# EAGLE design sceme1.0 (EAGLE 9.1.3)
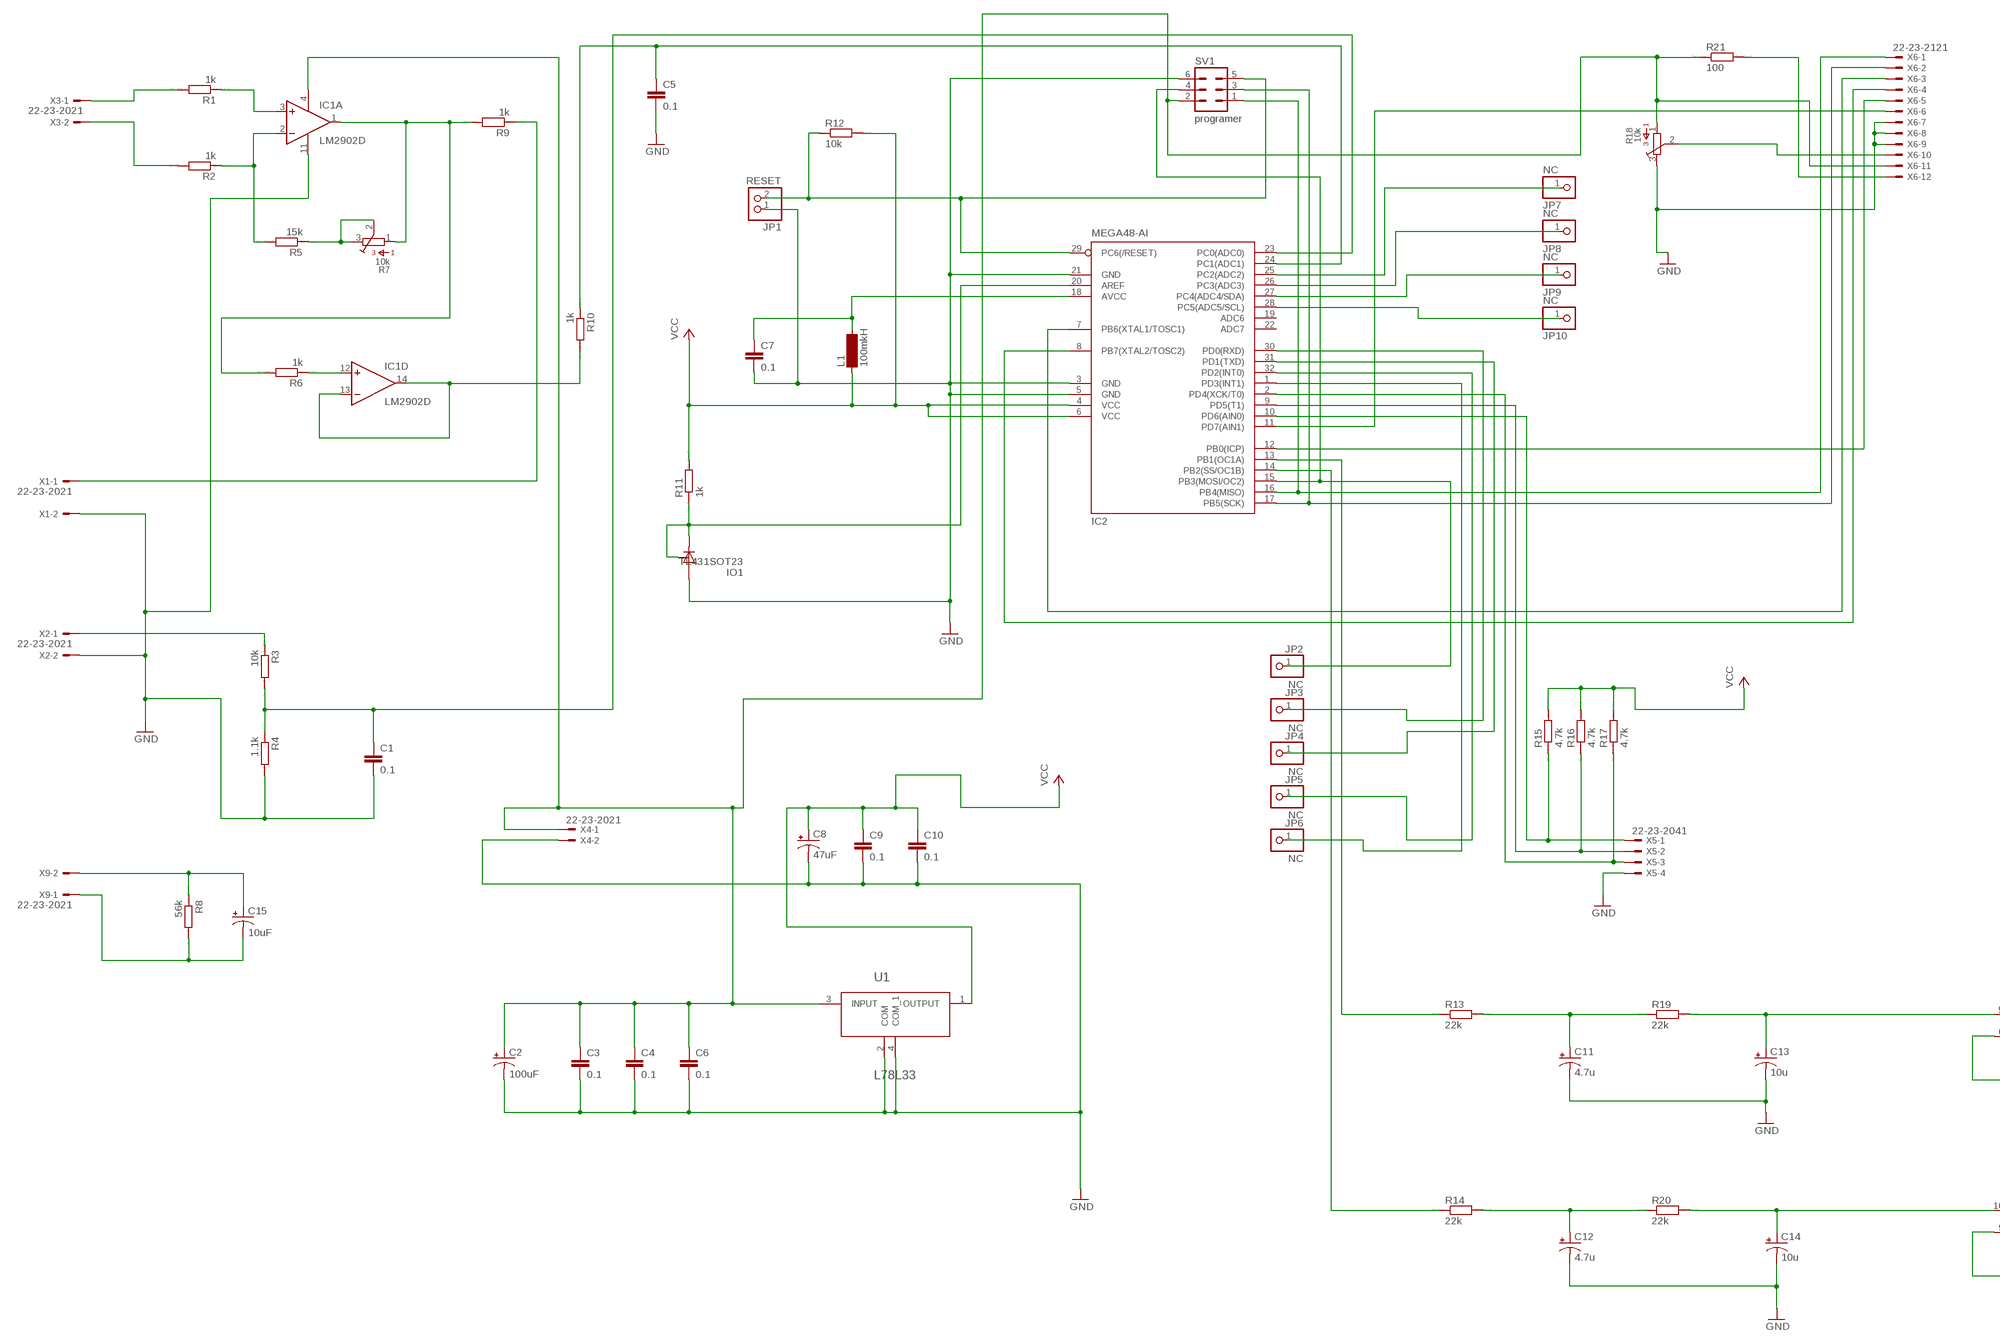
[diagram p0: schematic, sheet 1, part 1 of 2]
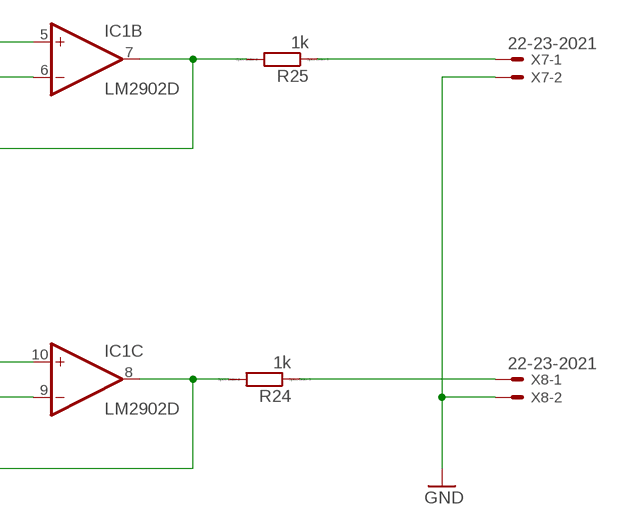
[diagram p1: schematic, sheet 1, part 2 of 2]

## Parts
C1  0.1  C-EUC0805  [C0805]
C2  100uF  CPOL-USE2.5-5  [E2,5-5]
C3  0.1  C-EUC0805  [C0805]
C4  0.1  C-EUC0805  [C0805]
C5  0.1  C-EUC0805  [C0805]
C6  0.1  C-EUC0805  [C0805]
C7  0.1  C-EUC0805  [C0805]
C8  47uF  CPOL-USE2.5-5  [E2,5-5]
C9  0.1  C-EUC0805  [C0805]
C10  0.1  C-EUC0805  [C0805]
C11  4.7u  CPOL-USE2.5-5  [E2,5-5]
C12  4.7u  CPOL-USE2.5-5  [E2,5-5]
C13  10u  CPOL-USE2.5-5  [E2,5-5]
C14  10u  CPOL-USE2.5-5  [E2,5-5]
C15  10uF  CPOL-USE2.5-5  [E2,5-5]
IC1  LM2902D  [SO14]
IC2  MEGA48-AI  MEGA8-AI  [TQFP32-08]
IO1  TL431SOT23  [SOT23]
JP1  RESET  PINHD-1X2  [1X02]
JP2  NC  PINHD-1X1  [1X01]
JP3  NC  PINHD-1X1  [1X01]
JP4  NC  PINHD-1X1  [1X01]
JP5  NC  PINHD-1X1  [1X01]
JP6  NC  PINHD-1X1  [1X01]
JP7  NC  PINHD-1X1  [1X01]
JP8  NC  PINHD-1X1  [1X01]
JP9  NC  PINHD-1X1  [1X01]
JP10  NC  PINHD-1X1  [1X01]
L1  100mkH  SM-1206  [SM-1206]
R1  1k  R  [R0805]
R2  1k  R  [R0805]
R3  10k  R  [R0805]
R4  1.1k  R  [R0805]
R5  15k  R  [R0805]
R6  1k  R  [R0805]
R7  10k  3362P  [3362P]
R8  56k  R  [R0805]
R9  1k  R  [R0805]
R10  1k  R  [R0805]
R11  1k  R  [R0805]
R12  10k  R  [R0805]
R13  22k  R  [R0805]
R14  22k  R  [R0805]
R15  4.7k  R  [R0805]
R16  4.7k  R  [R0805]
R17  4.7k  R  [R0805]
R18  10k  3362P  [3362P]
R19  22k  R  [R0805]
R20  22k  R  [R0805]
R21  100  R  [R0805]
R24  1k  R  [R0805]
R25  1k  R  [R0805]
SV1  programer  ML6  [ML6]
U1  L78L33  UA78L05CPK  [SOT150P400X160-4N]
X1  22-23-2021  [22-23-2021]
X2  22-23-2021  [22-23-2021]
X3  22-23-2021  [22-23-2021]
X4  22-23-2021  [22-23-2021]
X5  22-23-2041  [22-23-2041]
X6  22-23-2121  [22-23-2121]
X7  22-23-2021  [22-23-2021]
X8  22-23-2021  [22-23-2021]
X9  22-23-2021  [22-23-2021]

## Nets
GND: C1.2 C2.- C3.2 C4.2 C5.2 C6.2 C7.2 C8.- C9.2 C10.2 C11.- C12.- C13.- C14.- IC1.11(P:V-) IC2.3(GND) IC2.5(GND) IC2.21(GND) IO1.3(A) JP1.1 R4.2 R18.3 SV1.6 U1.2(COM) U1.4(COM_1) X1.2 X2.2 X4.2 X5.4 X6.7 X6.8 X6.9 X7.2 X8.2
N$1: C11.+ R13.2 R19.1
N$2: C13.+ IC1.5(B:+IN) R19.2
N$3: C12.+ R14.2 R20.1
N$4: C14.+ IC1.10(C:+IN) R20.2
N$5: IC2.20(AREF) IO1.1(C) IO1.2(R) R11.1
N$6: IC2.12(PB0(ICP)) X6.5
N$7: IC2.11(PD7(AIN1)) X6.6
N$8: R21.2 X6.12
N$9: C15.+ R8.1 X9.2
N$10: C7.1 IC2.18(AVCC) L1.2
N$11: R18.2 X6.10
N$12: IC2.29(PC6(/RESET)) JP1.2 R12.1 SV1.5
N$13: C15.- R8.2 X9.1
N$14: IC2.7(PB6(XTAL1/TOSC1)) X6.3
N$15: IC2.17(PB5(SCK)) SV1.3 X6.2
N$16: IC2.16(PB4(MISO)) SV1.1 X6.1
N$17: IC2.30(PD0(RXD)) JP3.1
N$18: IC2.31(PD1(TXD)) JP4.1
N$19: IC2.10(PD6(AIN0)) R15.1 X5.1
N$20: IC2.9(PD5(T1)) R16.1 X5.2
N$21: IC2.2(PD4(XCK/T0)) R17.1 X5.3
N$22: IC2.32(PD2(INT0)) JP5.1
N$23: IC2.1(PD3(INT1)) JP6.1
N$24: IC2.8(PB7(XTAL2/TOSC2)) X6.4
N$25: IC2.13(PB1(OC1A)) R13.1
N$26: IC2.14(PB2(SS/OC1B)) R14.1
N$27: IC2.15(PB3(MOSI/OC2)) JP2.1 SV1.4
N$28: IC1.8(C:OUT) IC1.9(C:-IN) R24.2
N$29: IC1.6(B:-IN) IC1.7(B:OUT) R25.2
N$30: IC1.3(A:+IN) R1.1
N$31: IC1.2(A:-IN) R2.1 R5.2
N$32: R5.1 R7.2 R7.3
N$33: IC1.1(A:OUT) R6.2 R7.1 R9.2
N$34: R1.2 X3.1
N$35: R25.1 X7.1
N$37: IC1.12(D:+IN) R6.1
N$38: C5.1 IC2.24(PC1(ADC1)) R10.1
N$39: R24.1 X8.1
N$40: R9.1 X1.1
N$41: R2.2 X3.2
N$42: C1.1 IC2.23(PC0(ADC0)) R3.2 R4.1
N$43: R3.1 X2.1
N$44: IC2.25(PC2(ADC2)) JP7.1
N$45: IC2.26(PC3(ADC3)) JP8.1
N$46: IC1.13(D:-IN) IC1.14(D:OUT) R10.2
N$47: IC2.27(PC4(ADC4/SDA)) JP9.1
N$48: IC2.28(PC5(ADC5/SCL)) JP10.1
N$57: C2.+ C3.1 C4.1 C6.1 IC1.4(P:V+) R18.1 R21.1 SV1.2 U1.3(INPUT) X4.1 X6.11
VCC: C8.+ C9.1 C10.1 IC2.4(VCC) IC2.6(VCC) L1.1 R11.2 R12.2 R15.2 R16.2 R17.2 U1.1(OUTPUT)
Unconnected: IC2.19(ADC6) IC2.22(ADC7)

## Library data of the parts
C1 C3-C7 C9 C10 = rcl:C-EU: CAPACITOR, European symbol
C2 C8 C11-C15 = rcl:CPOL-US: POLARIZED CAPACITOR, American symbol; SPICEPREFIX: C
IC1 = linear:LM2902: Low power quad operational amplifier Source: Data sgeet <http://www.st.com/internet/com/TECHNICAL_RESOURCES/TECHNICAL_LITERATURE/DATASHEET/CD00000533.pdf>
IC2 = atmel:MEGA8: MICROCONTROLLER 8 Kbytes FLASH, 1 kbytes SRAM, 512 bytes EEPROM, USART, 6-channel 10 bit ADC, 2-channel 8 bit ADC Pin compatible with Atmega48, ATMega88, ATMega168 Source: avr.lbr; MPN: ATMEGA8-16AU; OC_FARNELL: 9171371; OC_NEWARK: 73M8863
IO1 = tl431me:TL431: Programmable Shunt Regulator TL431 Features > Programmable Output Voltage to 36 Volts > Low Dynamic Output Impedance 0.2? Typical > Sink Current Capability of 1.0 to 100mA > Equivalent Full-Range Temperature Coefficient of 50ppm/°C Typical > Temperature Compensated For Operation Over Full Rated Operating Temperature Range > Low Output Noise Voltage > Fast Turn-on Response; MPN: TL431BFDT; OC_FARNELL: 2095471; PACKAGE: SOT23; SUPPLIER: NXP
JP1 = pinhead:PINHD-1X2: PIN HEADER
JP2-JP10 = pinhead:PINHD-1X1: PIN HEADER
L1 = inductor-neosid:SM-1206: INDUCTOR SMD chip inductor; OC_FARNELL: unknown; OC_NEWARK: unknown
R1-R6 R8-R17 R19-R21 R24 R25 = eagle-ltspice:R: RESISTOR, European symbol; SPICEMODEL: NONE; SPICEPREFIX: R
R7 R18 = bourns:3362: 3362 Series 1/4" Square Trimmer
SV1 = con-harting-ml:ML6: HARTING; OC_FARNELL: unknown; OC_NEWARK: unknown
U1 = TI-Eagle_library:UA78L05: μA78L00 SERIES POSITIVE-VOLTAGE REGULATORS,SOT-89-3; MPN: UA78L05CPK; OC_FARNELL: 2112604; OC_NEWARK: 77C1862; PACKAGE: SOT-89-3; SUPPLIER: TEXAS INSTRUMENTS
X1-X4 X7-X9 = con-molex:22-23-2021: .100" (2.54mm) Center Header - 2 Pin; MF: MOLEX; MPN: 22-23-2021; OC_FARNELL: 1462926; OC_NEWARK: 25C3832
X5 = con-molex:22-23-2041: .100" (2.54mm) Center Header - 4 Pin; MF: MOLEX; MPN: 22-23-2041; OC_FARNELL: 1462920; OC_NEWARK: 38C0355
X6 = con-molex:22-23-2121: .100" (2.54mm) Center Header - 12 Pin; MF: MOLEX; MPN: 22-23-2121; OC_FARNELL: 1462935; OC_NEWARK: 56H0456

## Net classes
0 default: clearance 0.205 mm

## Board
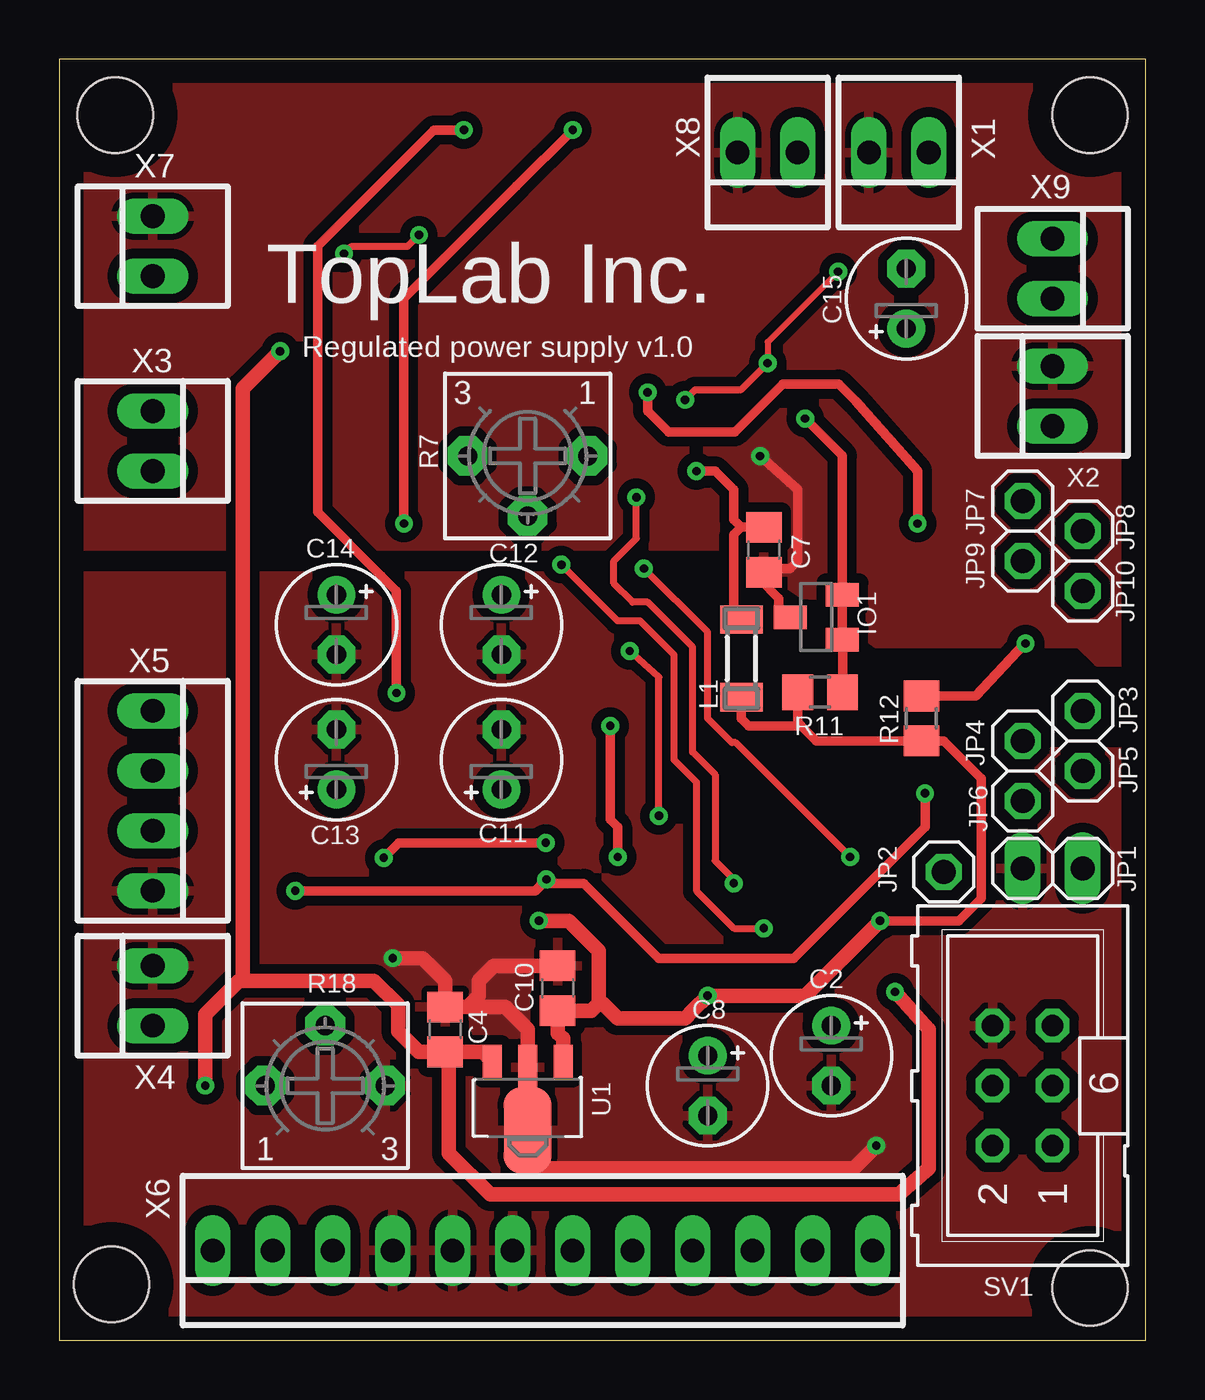
[diagram p2: board, top side]
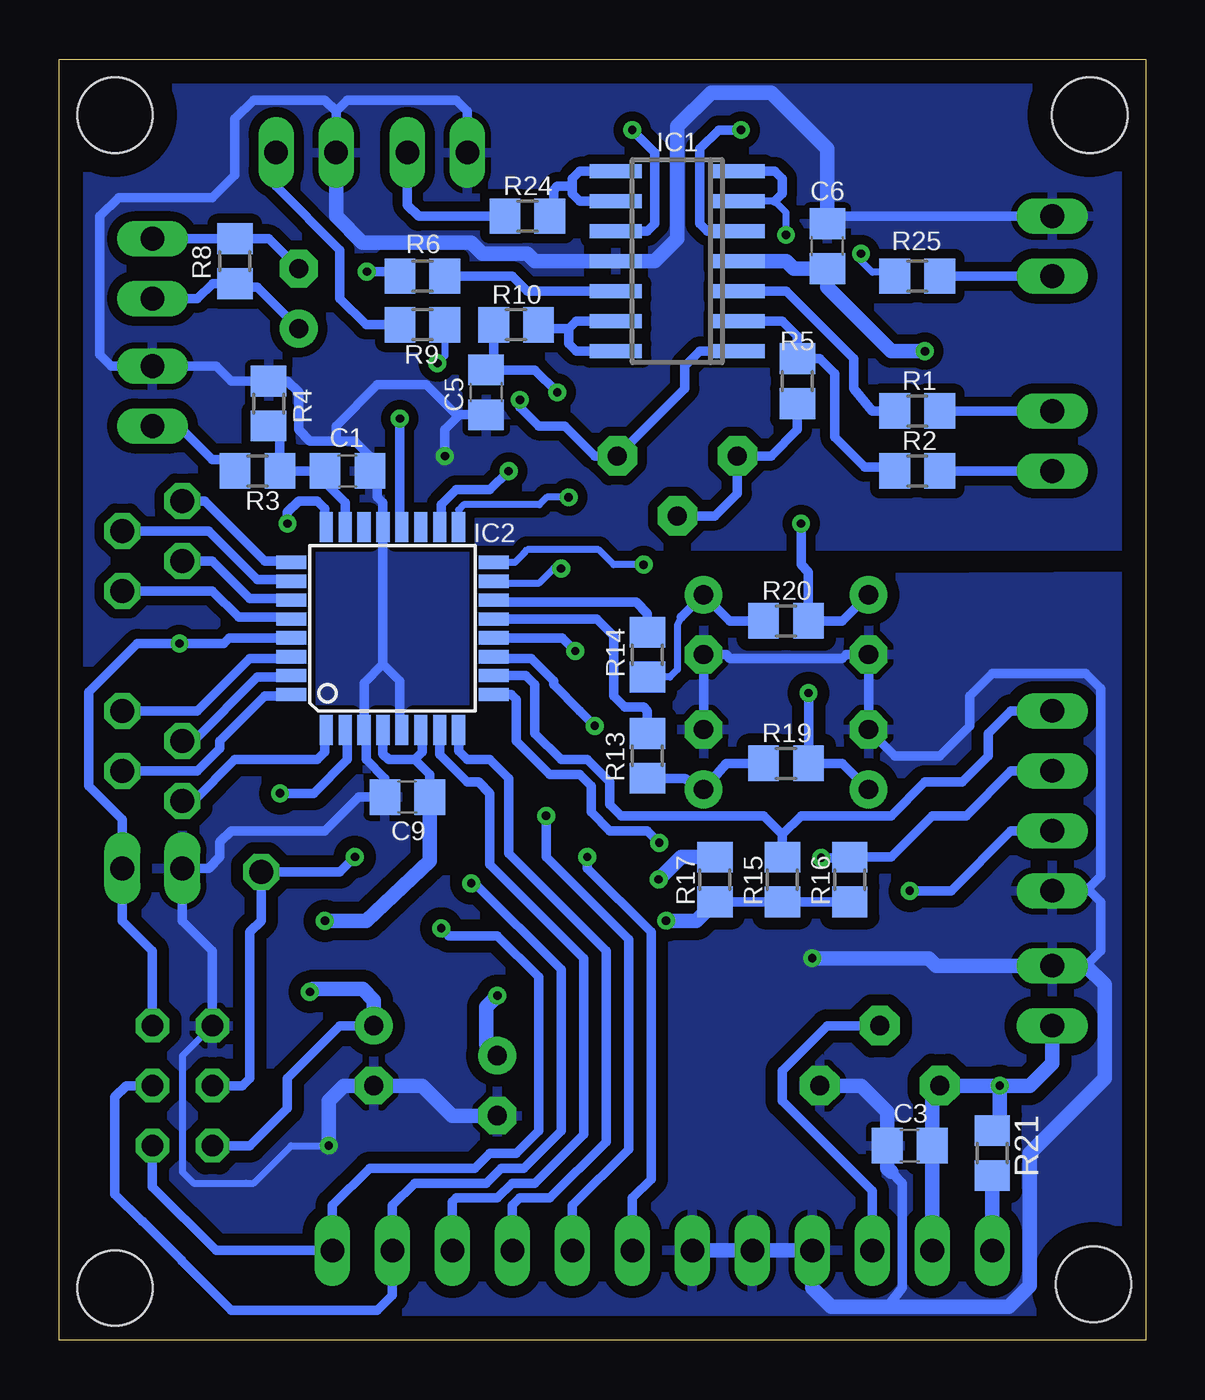
[diagram p3: board, bottom side, seen from below]

Size 46.02 x 54.28 mm. Coordinates in mm from the lower left corner, seen from the top.
Outline: 0,0 46.02,0 46.02,54.28 0,54.28 0,0
Copper layers (1*16): Top 0.035mm / dielectric 1.5mm / Bottom 0.035mm
Design rules "default": minimum track width 10mil, minimum drill 24mil, track to track 8mil, track to pad 8mil, pad to pad 8mil, via to via 8mil, smd to smd 8mil, copper to edge 40mil, drill to drill 8mil, minimum pad ring 10mil, minimum via ring 8mil, stop-mask expansion 4mil, vias tented up to drill 0mil, thermal gap 10mil
Holes 3.2 mm at 2.22,2.38 43.66,2.22 2.38,51.91 43.66,51.91

### Footprints (pad centres in the part's own frame; a part is rotated, then mirrored left to right if it is on the bottom)
C0805 = smd 1.3 x 1.5: 1 -0.95,0; 2 0.95,0
E2,5-5 = drill 0.813 pad 1.6: + -1.27,0 | drill 0.813 pad 1.6 octagon: - 1.27,0
SO14 = smd 0.6 x 2.2: 1 -3.81,-2.6; 2 -2.54,-2.6; 3 -1.27,-2.6; 4 0,-2.6; 5 1.27,-2.6; 6 2.54,-2.6; 7 3.81,-2.6; 8 3.81,2.6; 9 2.54,2.6; 10 1.27,2.6; 11 0,2.6; 12 -1.27,2.6; 13 -2.54,2.6; 14 -3.81,2.6
TQFP32-08 = smd 1.27 x 0.559: 1 -4.293,2.8; 2 -4.293,2; 3 -4.293,1.2; 4 -4.293,0.4; 5 -4.293,-0.4; 6 -4.293,-1.2; 7 -4.293,-2; 8 -4.293,-2.8; 17 4.293,-2.8; 18 4.293,-2; 19 4.293,-1.2; 20 4.293,-0.4; 21 4.293,0.4; 22 4.293,1.2; 23 4.293,2; 24 4.293,2.8 | smd 0.559 x 1.27: 9 -2.8,-4.293; 10 -2,-4.293; 11 -1.2,-4.293; 12 -0.4,-4.293; 13 0.4,-4.293; 14 1.2,-4.293; 15 2,-4.293; 16 2.8,-4.293; 25 2.8,4.293; 26 2,4.293; 27 1.2,4.293; 28 0.4,4.293; 29 -0.4,4.293; 30 -1.2,4.293; 31 -2,4.293; 32 -2.8,4.293
SOT23 = smd 1 x 1.4: 1 -0.95,-1.1; 2 0.95,-1.1; 3 0,1.1
1X02 = drill 1.016 long: 1 -1.27,0; 2 1.27,0
1X01 = drill 1.016 octagon: 1 0,0
SM-1206 = smd 1.2 x 1.8: 1 -1.65,0; 2 1.65,0
R0805 = smd 1.3 x 1.5: 1 -0.95,0; 2 0.95,0
3362P = drill 0.813 pad 1.676 octagon: 1 -2.54,0; 2 0,2.54; 3 2.54,0
ML6 = drill 0.914 octagon: 1 -2.54,-1.27; 2 -2.54,1.27; 3 0,-1.27; 4 0,1.27; 5 2.54,-1.27; 6 2.54,1.27
SOT150P400X160-4N = smd 0.8 x 1.4: 1 -1.499,-1.981; 3 1.499,-1.981 | smd 0.8 x 1.9: 2 0,-1.727 | smd 2.032 x 3.65: 4 0,0.94
22-23-2021 = drill 1 long: 1 -1.27,0; 2 1.27,0
22-23-2041 = drill 1 long: 1 -3.81,0; 2 -1.27,0; 3 1.27,0; 4 3.81,0
22-23-2121 = drill 1 long: 1 -13.97,0; 2 -11.43,0; 3 -8.89,0; 4 -6.35,0; 5 -3.81,0; 6 -1.27,0; 7 1.27,0; 8 3.81,0; 9 6.35,0; 10 8.89,0; 11 11.43,0; 12 13.97,0

### Placement (x,y rotation side)
C1  33.81,36.83 0 bottom
C2  32.7,12.06 270 top
C3  10,8.26 180 bottom
C4  16.35,13.18 90 top
C5  27.94,40.16 270 bottom
C6  13.49,46.35 90 bottom
C7  29.84,33.5 270 top
C8  27.46,10.79 270 top
C9  31.27,23.02 180 bottom
C10  21.11,14.92 90 top
C11  18.73,24.61 90 top
C12  18.73,30.32 270 top
C13  11.75,24.61 90 top
C14  11.75,30.32 270 top
C15  35.88,44.13 90 top
IC1  19.84,45.72 90 bottom
IC2  31.91,30.16 90 bottom
IO1  32.07,30.64 90 top
JP1  42.07,20 0 top
JP2  37.47,19.84 0 top
JP3  43.34,26.67 0 top
JP4  40.8,25.4 0 top
JP5  43.34,24.13 0 top
JP6  40.8,22.86 0 top
JP7  40.8,35.56 0 top
JP8  43.34,34.29 0 top
JP9  40.8,33.02 0 top
JP10  43.34,31.75 0 top
L1  28.89,28.89 90 top
R1  9.68,39.37 0 bottom
R2  9.68,36.83 0 bottom
R3  37.62,36.83 0 bottom
R4  37.15,39.69 90 bottom
R5  14.76,40.64 90 bottom
R6  30.64,45.09 180 bottom
R7  19.84,37.47 180 top
R8  38.58,45.72 90 bottom
R9  30.64,43.02 0 bottom
R10  26.67,43.02 0 bottom
R11  32.23,27.46 180 top
R12  36.51,26.35 270 top
R13  21.11,24.77 270 bottom
R14  21.11,29.05 270 bottom
R15  15.4,19.53 270 bottom
R16  12.54,19.53 270 bottom
R17  18.26,19.53 270 bottom
R18  11.27,10.79 0 top
R19  15.24,24.45 0 bottom
R20  15.24,30.48 0 bottom
R21  6.51,7.94 270 bottom
R24  26.19,47.62 0 bottom
R25  9.68,45.09 180 bottom
SV1  40.8,10.79 90 top
U1  19.84,9.84 180 top
X1  35.56,50.32 180 top
X2  42.07,40.01 90 top
X3  3.97,38.1 270 top
X4  3.97,14.61 90 top
X5  3.97,22.86 270 top
X6  20.48,3.81 180 top
X7  3.97,46.35 90 top
X8  30,50.32 180 top
X9  42.07,45.4 270 top

### Tracks (layer width: path | path; a pad name or v marks a point on that pad's centre or on a via)
GND  (via drill 0.35 pad 0.75)
  Top 0.406: 30.48,30.96 30.48,30.8 30.64,30.64 IO1.3 30.8,30.64 30.48,30.96 | 30.48,30.96 30.48,31.43 29.69,32.23 29.84,32.23 30.32,32.7 30.96,32.7 31.27,33.02 31.27,36.04 v29.69,37.47 | U1.2 U1.4
  Top 0.61: C10.2 18.41,15.88 17.78,15.24 17.78,14.61 17.3,14.13 | v14.13,16.19 15.4,16.19 16.35,15.24 C4.2 17.3,14.13 | U1.4 19.84,7.3 33.66,7.3 v34.61,8.26 | U1.2 19.84,13.18 18.89,14.13 17.3,14.13
  Bottom 0.305: SV1.6 40.8,12.06 40.8,7.14 40.32,6.67 38.1,6.67 37.78,6.67 36.2,8.26 v34.61,8.26
  Bottom 0.406: SV1.6 39.53,16.51 40.8,17.78 JP1.1 39.69,20 39.21,20.48 39.21,21.11 38.73,21.59 34.77,21.59 33.34,23.02 C9.2 32.22,23.81 33.02,24.61 33.02,25.78 IC2.3 33.11,27.86 32.31,28.66 | 10.79,7.14 10.32,6.67 10.32,2.22 10.95,1.43 | X7.2 13.17,47.62 C6.2 | C11.- C12.- 17.78,29.05 17.62,28.89 12.86,28.89 12.7,29.05 C14.- C13.- 10.64,24.77 8.73,24.77 7.46,26.04 7.46,27.3 6.51,28.26 2.54,28.26 1.91,27.62 1.91,19.68 2.38,19.21 | 34.29,38.1 33.5,38.1 32.86,37.47 C1.2 32.54,36.51 32.54,35.72 32.31,35.48 IC2.21 32.31,28.66 | 34.29,38.1 35.4,38.1 35.88,38.58 35.88,40.16 36.35,40.64 R4.2 38.73,40.64 39.37,41.27 X2.2 43.81,41.27 44.29,41.75 44.29,47.62 43.5,48.42 39.53,48.42 38.58,49.37 38.58,51.75 37.78,52.55 34.77,52.55 34.29,52.07 | X8.2 28.73,52.07 29.21,52.55 33.81,52.55 34.29,52.07 | X1.2 34.29,52.07 | 2.38,19.21 2.38,19.05 1.91,18.57 1.91,16.51 2.54,15.88 X4.2 | X5.4 2.54,19.05 2.38,19.21 | C5.2 29.05,39.21 | 29.05,39.21 29.21,39.21 30.48,40.48 32.54,40.48 34.29,38.73 34.29,38.1 | 32.31,28.66 31.59,27.94 31.59,25.95 IC2.5 | v29.69,37.47 29.69,38.58 29.05,39.21
  Bottom 0.61: X6.7 X6.8 X6.9 14.13,2.22 13.34,1.43 10.95,1.43 5.81,1.43 4.92,2.32 4.92,7.94 1.75,11.11 1.75,15.08 2.54,15.88 | 10.79,7.14 10.95,7.3 C3.2 10.95,9.68 12.06,10.79 R18.3 | C6.2 13.49,50.48 15.88,52.86 18.41,52.86 19.84,51.44 19.84,46.67 20.8,45.72 IC1.11 25.88,45.72 26.19,46.04 28.1,46.04 28.57,46.51 33.18,46.51 34.29,47.62 X1.2 | X4.2 8.89,15.88 9.21,16.19 v14.13,16.19 | v34.61,8.26 34.61,10.16 33.97,10.79 C2.- 30.64,10.79 29.37,9.53 C8.-
  pour Bottom (isolate 0.406): 0.32,53.98 45.72,53.98 45.72,28.73 43.97,28.73 43.18,29.53 35.4,29.53 35.4,26.67 28.42,26.67 28.42,33.66 0.32,33.66
  pour Top (isolate 0.406): 0.32,53.98 45.72,53.98 45.72,28.73 43.97,28.73 43.18,29.53 34.61,29.53 28.42,33.66 0.32,33.66
  pour Bottom (isolate 0.508): 0.32,32.38 25.4,32.23 25.4,24.92 45.88,24.92 45.88,0.16 0.16,0 0.16,32.38
  pour Top (isolate 0.406): 25.4,32.38 0.16,32.38 0.16,0 45.88,0 45.88,24.92 25.4,24.92
N$1
  Bottom 0.406: R13.2 19.52,23.81 C11.+ 17.78,24.45 R19.1
N$2  (via drill 0.35 pad 0.75)
  Top 0.406: v14.29,27.43 14.29,31.75 13.65,32.38 10.95,35.08 10.95,46.35 15.88,51.28 v17.14,51.28
  Bottom 0.406: R19.2 14.13,24.29 | C13.+ 12.86,24.45 R19.2 | v17.14,51.28 18.1,51.28 18.89,50.48 18.89,47.31 18.57,46.99 IC1.5 | R19.2 v14.29,27.43
N$3
  Bottom 0.305: 19.68,30.64 19.84,30.32 19.84,28.42 20.16,28.1 R14.2
  Bottom 0.406: 19.68,30.64 C12.+ 17.62,30.48 R20.1
N$4  (via drill 0.35 pad 0.75)
  Top 0.406: v14.61,34.61 14.61,44.13 19.37,48.9 v21.75,51.28
  Bottom 0.406: C14.+ 12.86,30.48 R20.2 14.29,32.55 14.61,32.86 v14.61,34.61 | v21.75,51.28 20.8,50.32 20.8,47.31 21.11,46.99 IC1.10
N$5  (via drill 0.35 pad 0.75)
  Top 0.406: R11.1 IO1.1 IO1.2 33.17,37.48 v31.59,39.05
  Bottom 0.406: IC2.20 31.59,34.54 v31.59,39.05 31.51,39.13
N$6  (via drill 0.35 pad 0.75)
  Top 0.305: v25.4,22.23 25.4,28.1 v24.16,29.21
  Bottom 0.406: X6.5 24.29,5.71 21.91,8.1 21.91,16.99 25.4,20.48 v25.4,22.23 | v24.16,29.21 24.71,29.76 IC2.12
N$7  (via drill 0.35 pad 0.75)
  Top 0.406: v23.34,26.04 23.34,22.07 23.65,21.75 v23.65,20.48
  Bottom 0.406: X6.6 21.75,6.03 20.95,6.83 20.95,17.3 23.65,20 v23.65,20.48 | IC2.11 27.55,28.89 26.04,28.89 25.08,27.94 25.08,27.78 23.97,26.67 v23.34,26.04
N$8
  Bottom 0.61: X6.12 R21.2
N$9
  Bottom 0.406: C15.+ 37.62,44.61 38.41,44.61 R8.1 39.53,44.77 40.16,44.13 X9.2
N$10  (via drill 0.35 pad 0.75)
  Top 0.406: L1.2 28.89,30.64 28.57,30.96 28.57,34.13 28.89,34.45 | 28.89,34.45 C7.1 | v26.99,36.83 27.78,36.83 28.57,36.04 28.57,34.77 28.89,34.45
  Bottom 0.406: IC2.18 29.84,34.52 29.84,35.4 29.21,36.04 27.78,36.04 v26.99,36.83
N$11
  Bottom 0.406: R18.2 13.49,13.34 15.4,11.43 15.4,10.16 11.59,6.35 X6.10
N$12  (via drill 0.35 pad 0.75)
  Top 0.406: R12.1 36.67,27.31 38.83,27.3 40.89,29.53 v40.93,29.53
  Bottom 0.406: SV1.5 42.07,16.51 43.34,17.78 JP1.2 43.34,22.07 44.77,23.5 44.77,27.46 42.7,29.53 v40.93,29.53 39.05,29.53 38.82,29.76 IC2.29
N$13
  Bottom 0.406: X9.1 R8.2 37.15,46.67 C15.-
N$14
  Bottom 0.406: X6.3 29.37,5.87 29.21,6.03 27.46,6.03 26.83,6.67 25.88,6.67 23.81,8.73 23.81,16.19 27.78,20.16 27.78,23.18 28.26,23.65 28.73,23.65 29.91,24.83 IC2.7
N$15  (via drill 0.35 pad 0.75)
  Top 0.305: v28.57,19.37 28.57,19.53 27.78,20.32 27.78,23.97 26.83,24.92 26.83,29.37 24.92,31.27 24.29,31.27 23.5,32.07 23.5,33.02 24.45,33.97 v24.45,35.72
  Bottom 0.305: IC2.17 29.11,35.19 28.89,35.4 25.69,35.4 25.37,35.72 v24.45,35.72
  Bottom 0.406: v28.57,19.37 28.42,19.37 24.77,15.72 24.77,8.89 26.35,7.3 27.3,7.3 27.94,6.67 30.96,6.67 31.91,5.71 X6.2 31.91,1.91 32.54,1.27 38.73,1.27 40.84,3.37 40.84,3.39 42.49,5.04 42.51,5.04 43.66,6.19 43.66,10.32 43.18,10.79 SV1.3
N$16  (via drill 0.35 pad 0.75)
  Top 0.305: v21.27,32.86 23.65,30.48 23.81,30.48 24.61,30.48 26.04,29.05 26.04,24.61 26.99,23.65 26.99,19.05 28.57,17.46 v29.84,17.46
  Bottom 0.305: IC2.16 26.73,32.96 26.35,33.34 26.19,33.5 23.18,33.5 22.54,32.86 v21.27,32.86
  Bottom 0.406: v29.84,17.46 29.53,17.14 27.46,17.14 25.72,15.4 25.72,8.89 26.67,7.94 27.78,7.94 28.42,7.3 32.86,7.3 34.45,5.71 X6.1 39.37,3.81 42.07,6.51 SV1.1
N$17
  Bottom 0.406: IC2.30 36.27,28.89 37.94,28.89 40.16,26.67 JP3.1
N$18
  Bottom 0.406: IC2.31 36.27,28.1 37.62,28.1 40.32,25.4 JP4.1
N$19
  Bottom 0.406: X5.1 5.71,26.67 6.67,25.72 6.67,24.77 7.78,23.65 9.37,23.65 10.79,22.23 14.61,22.23 15.4,21.43 | R15.1 15.4,21.43 | 15.4,21.43 16.19,22.23 22.23,22.23 22.7,22.7 22.7,23.65 23.65,24.61 24.77,24.61 25.88,25.72 25.88,27.78 26.26,28.16 IC2.10
N$20  (via drill 0.35)
  Top 0.406: v20.61,21.08 14.38,21.08 v13.75,20.45
  Bottom 0.406: X5.2 5.71,24.13 7.62,22.23 9.05,22.23 10.79,20.48 R16.1 12.57,20.45 v13.75,20.45 | IC2.9 26.89,27.36 26.67,27.15 26.67,25.4 25.24,23.97 23.97,23.97 23.5,23.5 23.5,22.38 22.7,21.59 21.11,21.59 v20.61,21.08
N$21  (via drill 0.35 pad 0.75)
  Top 0.406: v36.67,23.18 36.67,21.75 31.11,16.19 25.4,16.19 22.23,19.37 20.8,19.37 v20.64,19.53 20.16,19.05 v10,19.05
  Bottom 0.305: 33.97,25.81 IC2.2
  Bottom 0.406: X5.3 5.71,21.59 8.26,19.05 v10,19.05 | R17.1 | 20.48,19.53 v20.64,19.53 | IC2.2 33.81,25.77 33.81,24.61 35.24,23.18 v36.67,23.18
  Bottom 0.61: v20.64,19.53 19.69,20.48 R17.1
N$22
  Bottom 0.406: IC2.32 36.26,27.3 37.31,27.3 39.21,25.4 39.21,25.08 40.16,24.13 JP5.1
N$23
  Bottom 0.406: IC2.1 34.77,25.81 34.77,24.92 35.08,24.61 38.58,24.61 40.32,22.86 JP6.1
N$24
  Bottom 0.406: X6.4 26.83,5.71 26.51,6.03 25.24,6.03 22.86,8.41 22.86,16.51 26.99,20.64 26.99,23.81 27.78,24.61 28.73,24.61 29.11,24.98 IC2.8
N$25
  Bottom 0.406: R13.1 21.11,26.67 21.27,26.83 22.07,26.83 22.54,27.3 22.54,29.84 23.26,30.56 IC2.13
N$26
  Bottom 0.406: IC2.14 27.53,31.27 21.59,31.27 21.11,30.8 R14.1
N$27  (via drill 0.35 pad 0.75)
  Top 0.305: v24.77,32.7 27.46,30 27.46,26.35 28.5,25.32 28.65,25.32 v33.5,20.48
  Bottom 0.305: v24.77,32.7 25.08,32.7 25.72,32.07 27.52,32.07 IC2.15
  Bottom 0.406: SV1.4 38.26,10.79 37.94,11.11 37.94,17.3 37.47,17.78 JP2.1 34.13,19.84 v33.5,20.48
N$28
  Bottom 0.406: IC1.8 23.97,49.53 24.29,49.21 24.29,48.9 | 24.29,48.9 24.29,48.58 23.97,48.26 IC1.9 | R24.2 25.08,47.79 25.08,48.74 24.92,48.9 24.29,48.9
N$29  (via drill 0.35)
  Top 0.305: v12.06,46.04 12.38,46.35 14.76,46.35 v15.24,46.83
  Bottom 0.305: R25.2 10.79,45.24 11.59,45.24 12.06,45.72 v12.06,46.04 | v15.24,46.83 15.24,47.78 15.72,48.26 IC1.6
  Bottom 0.406: IC1.7 15.72,49.53 15.4,49.21 15.4,48.58 15.72,48.26
N$30
  Bottom 0.406: R1.1 11.59,39.37 12.38,40.32 12.38,41.59 15.24,44.45 IC1.3
N$31
  Bottom 0.406: R2.1 10.79,36.99 11.91,36.99 13.18,38.26 13.18,40.96 13.81,41.59 R5.2 14.76,42.55 15.4,43.18 IC1.2
N$32
  Bottom 0.406: R7.2 18.26,34.92 17.3,35.88 R7.3 15.88,37.47 14.76,38.58 R5.1
N$33  (via drill 0.35)
  Top 0.254: 30.13,41.53 v30,41.4 30,42.29 v32.99,45.28
  Top 0.305: v30,41.4 28.86,40.26 26.92,40.26 v26.51,39.85
  Bottom 0.305: R9.2 29.69,41.72 v30,41.4
  Bottom 0.406: IC1.1 18.89,41.91 19.53,41.27 19.53,40.32 R7.1 23.34,37.47 24.61,38.73 25.72,38.73 26.51,39.53 v26.51,39.85 | R9.2 | v32.99,45.28 31.78,45.28 R6.2
N$34
  Bottom 0.406: R1.2 X3.1
N$35
  Bottom 0.406: R25.1 X7.1
N$37
  Bottom 0.406: IC1.12 26.19,44.45 26.83,45.09 R6.1
N$38  (via drill 0.35 pad 0.75)
  Top 0.406: v36.35,34.61 36.35,36.83 33.73,39.79 33.01,40.51 30.64,40.51 28.61,38.48 25.81,38.48 24.92,39.37 v24.92,40.16
  Bottom 0.406: IC2.24 34.77,34.51 34.77,35.24 35.08,35.56 35.88,35.56 36.35,35.08 v36.35,34.61 | R10.1 27.62,41.12 C5.1 25.87,41.11 v24.92,40.16
N$39
  Bottom 0.406: R24.1 30.8,47.62 31.27,48.1 X8.1
N$40
  Bottom 0.406: R9.1 33.02,43.02 34.13,44.13 34.13,46.2 36.83,48.9 X1.1
N$41
  Bottom 0.406: R2.2 X3.2
N$42
  Bottom 0.406: C1.1 R3.2 36.67,38.57 36.67,38.58 36.99,38.58 R4.1 | 34.45,36.52 C1.1 | IC2.23 33.91,35.5 34.76,36.35 C1.1
N$43
  Bottom 0.406: R3.1 39.05,37.31 39.53,37.31 40.96,38.73 X2.1
N$44
  Bottom 0.406: IC2.25 36.26,33.02 37.31,33.02 39.85,35.56 JP7.1
N$45
  Bottom 0.406: IC2.26 36.27,32.23 37.62,32.23 39.69,34.29 JP8.1
N$46
  Bottom 0.406: IC1.14 24.13,41.91 24.45,42.23 24.45,42.86 | IC1.13 24.13,43.18 24.45,42.86 | 24.45,42.86 25.88,42.86 R10.2
N$47
  Bottom 0.406: IC2.27 36.27,31.43 37.94,31.43 39.53,33.02 JP9.1
N$48
  Bottom 0.406: IC2.28 36.28,30.64 38.42,30.64 39.53,31.75 JP10.1
N$57  (via drill 0.35 pad 0.75)
  Top 0.254: 7.78,15.4 7.62,15.24 | C4.1 16.51,12.06
  Top 0.61: v9.36,41.9 7.78,40.32 7.78,17.45 7.78,15.4 | 16.51,12.06 16.51,7.94 18.26,6.19 35.56,6.19 36.83,7.3 36.83,13.18 v35.4,14.76 | U1.3 17.94,12.23 C4.1 15.24,12.23 14.37,13.1 14.37,14.21 13.34,15.24 7.62,15.24 6.19,13.81 v6.19,10.79
  Bottom 0.406: SV1.2 37.94,8.26 36.35,9.84 36.35,11.11 34.13,13.34 C2.+
  Bottom 0.61: X4.1 3.97,11.75 4.92,10.79 v6.19,10.79 | v6.19,10.79 6.19,9.21 R21.1 | v6.19,10.79 R18.1 9.05,10.47 C3.1 X6.11 | IC1.4 15.24,45.72 14.92,45.4 C6.1 | C6.1 | C6.1 13.5,44.61 10.79,41.91 v9.36,41.9 | C2.+ 32.7,14.41 33.17,14.88 35.28,14.88 v35.4,14.76
VCC  (via drill 0.35, 0.35 pad 0.75)
  Top 0.406: R12.2 35.4,25.4 | R11.2 31.27,26.19 31.43,26.04 | L1.1 28.89,26.35 29.21,26.04 31.43,26.04 | 35.4,25.4 32.07,25.4 31.43,26.04 | 35.4,25.4 37.47,25.4 39.05,23.81 39.05,18.73 38.1,17.78 v34.77,17.78
  Top 0.61: C10.1 | C10.1 21.34,13.74 | U1.1 21.34,12.79 21.11,13.02 C10.1 | C10.1 22.54,13.97 22.86,14.29 | 22.86,14.29 22.86,16.51 21.59,17.78 v20.32,17.78 | 22.86,14.29 23.02,14.29 23.65,13.65 26.51,13.65 26.83,13.97 v27.46,14.61 31.59,14.61 v34.77,17.78
  Bottom 0.406: R16.2 R15.2 R17.2 | IC2.4 32.31,24.85 32.07,24.61 30.96,24.61 | 30.96,24.61 30.64,24.92 30.64,25.8 IC2.6 | C9.1 30.32,23.97 30.96,24.61
  Bottom 0.61: v34.77,17.78 33.02,17.78 30.32,20.32 C9.1 | C8.+ 27.94,12.54 27.94,14.13 v27.46,14.61 | v20.32,17.78 19.05,17.78 R17.2

### Text on the board
tPlace: TopLab Inc. | Regulated power supply v1.0